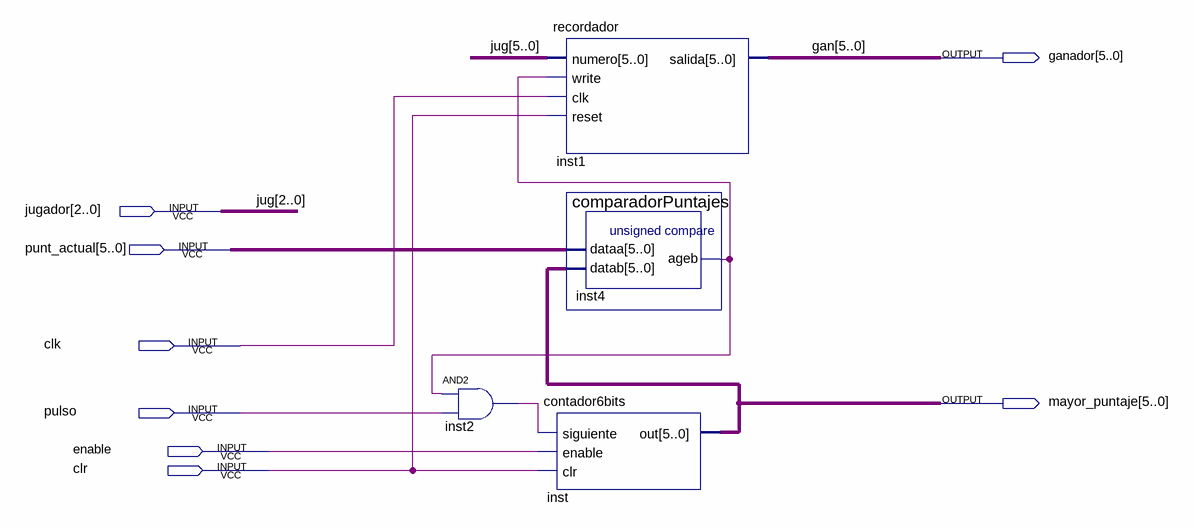
[diagram p0: schematic sheet]
// Quartus schematic guardar_ganador.bdf as structural Verilog: 4 symbols, 8 pins
module guardar_ganador (
  input  [2:0] jugador,
  input  [5:0] punt_actual,
  input  clk,
  input  pulso,
  input  enable,
  input  clr,
  output [5:0] ganador,
  output [5:0] mayor_puntaje
);

  wire inst2_out, inst4_ageb;
  wire [5:3] jug;

  and inst2 (inst2_out, inst4_ageb, pulso);
  recordador inst1 (.numero({jug, jugador}), .write(inst4_ageb), .clk(clk), .reset(clr), .salida(ganador));
  comparadorPuntajes inst4 (.dataa(punt_actual), .datab(mayor_puntaje), .ageb(inst4_ageb));
  contador6bits inst (.siguiente(inst2_out), .enable(enable), .clr(clr), .out(mayor_puntaje));

  // Other names for the same wires on the sheet: gan[5:0] = ganador; jug[2:0] = jugador
endmodule
